# EAGLE schematic max3232 (EAGLE 6.4)
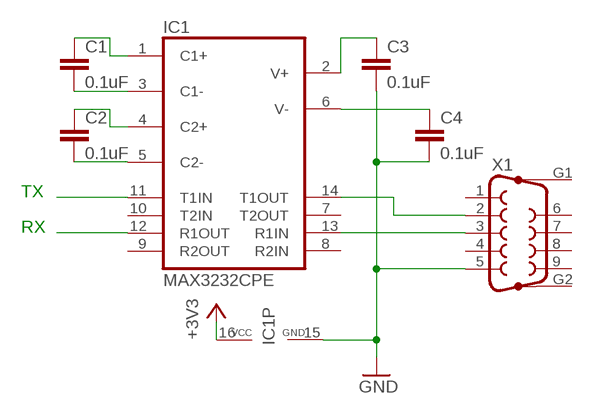
[diagram p0: schematic, sheet 1]

## Parts
C1  0.1uF  C-EU025-024X044  [C025-024X044]
C2  0.1uF  C-EU025-024X044  [C025-024X044]
C3  0.1uF  C-EU025-024X044  [C025-024X044]
C4  0.1uF  C-EU025-024X044  [C025-024X044]
IC1  MAX3232CPE  [DIL16]
X1  F09HP  [F09HP]

## Nets
+3V3: IC1.16(VCC)
GND: C3.2 C4.2 IC1.15(GND) X1.5
N$1: C2.2 IC1.5(C2-)
N$2: C2.1 IC1.4(C2+)
N$3: C1.2 IC1.3(C1-)
N$4: C1.1 IC1.1(C1+)
N$5: C3.1 IC1.2(V+)
N$6: C4.1 IC1.6(V-)
N$7: IC1.14(T1OUT) X1.2
N$8: IC1.13(R1IN) X1.3
N$9: IC1.11(T1IN)
N$10: IC1.12(R1OUT)
Unconnected: IC1.7(T2OUT) IC1.8(R2IN) IC1.9(R2OUT) IC1.10(T2IN) X1.1 X1.4 X1.6 X1.7 X1.8 X1.9 X1.G1 X1.G2

## Notes on the sheet
- TX
- RX

## Library data of the parts
C1-C4 = rcl:C-EU: CAPACITOR, European symbol
IC1 = maxim:MAX3232*: True RS-232 Transceivers 3.0V to 5.5V, Low-Power up to 1Mbps, Using Four 0.1µF External Capacitors Source: http://pdfserv.maxim-ic.com/en/ds/MAX3222-MAX3241.pdf; MF: MAXIM; MPN: MAX3232CPE+; OC_FARNELL: 9724494; OC_NEWARK: 68K4626
X1 = con-subd:F09HP: SUB-D; OC_FARNELL: unknown; OC_NEWARK: unknown